# EAGLE schematic UnoRoverWithL298 (EAGLE 7.3.0)
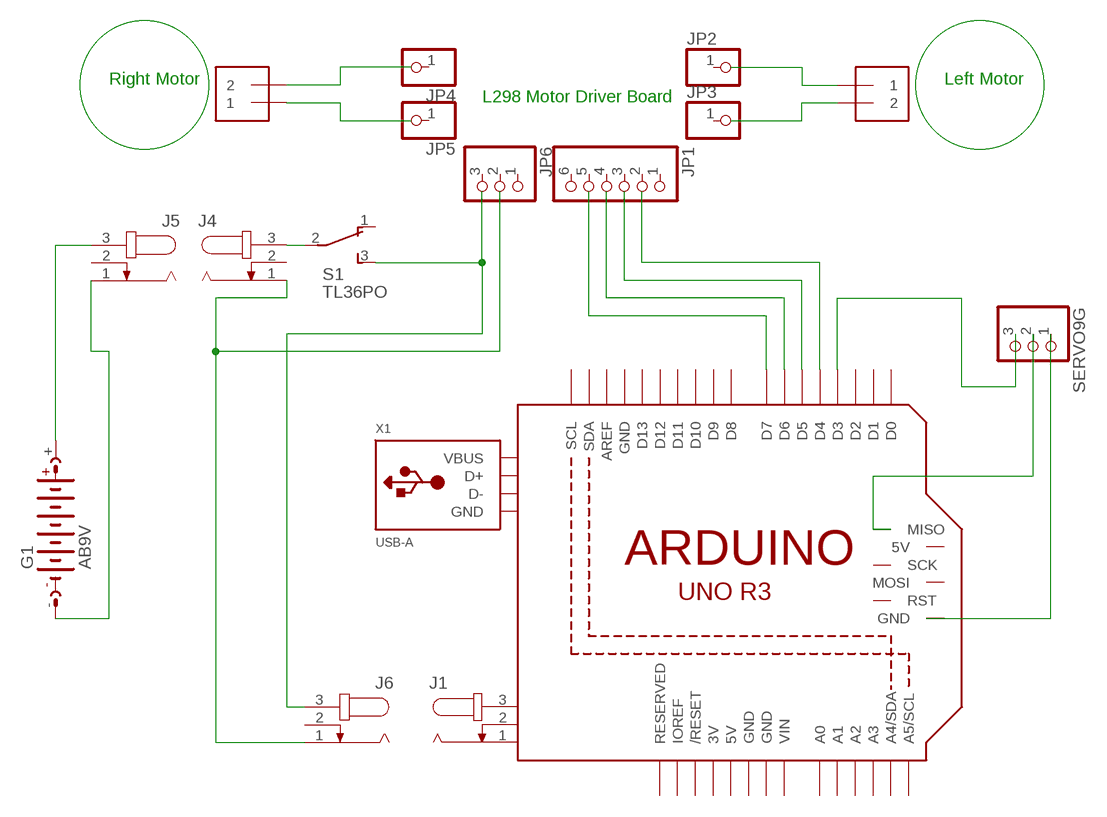
[diagram p0: schematic, sheet 1]

## Parts
G1  AB9V  [AB9V]
J1  RAPC7120  [RAPC712]
J2  1X2-3.5MM  [1X2-3.5MM]
J3  1X2-3.5MM  [1X2-3.5MM]
J4  RAPC7120  [RAPC712]
J5  RAPC7120  [RAPC712]
J6  RAPC7120  [RAPC712]
JP1  PINHD-1X6  [1X06]
JP2  PINHD-1X1  [1X01]
JP3  PINHD-1X1  [1X01]
JP4  PINHD-1X1  [1X01]
JP5  PINHD-1X1  [1X01]
JP6  PINHD-1X3  [1X03]
M1  ARDUINO_R3_ICSP  [ARDUINOR3_ICSP]
S1  TL36PO  [TL3XPO]
SERVO9G  PINHD-1X3  [1X03]
X1  USB-A  [MOLEX_480371000]

## Nets
N$1: J2.2
N$2: J2.1
N$3: J3.2
N$4: J3.1
N$5: M1.D4
N$6: M1.D5
N$7: M1.D6
N$8: M1.D7
N$9: M1.D3 SERVO9G.3
N$12: J4.3 S1.2(P)
N$13: J6.3 S1.3(S)
N$14: G1.+ J5.3
N$15: G1.- J5.1
N$16: J4.1 J6.1
Unconnected: J1.1 J1.2 J1.3 J4.2 J5.2 J6.2 JP1.1 JP1.2 JP1.3 JP1.4 JP1.5 JP1.6 JP2.1 JP3.1 JP4.1 JP5.1 JP6.1 JP6.2 JP6.3 M1.5V_ICSP(5V) M1.A0 M1.A1 M1.A2 M1.A3 M1.A4(A4/SDA) M1.A5(A5/SCL) M1.AREF M1.D0 M1.D1 M1.D2 M1.D8 M1.D9 M1.D10 M1.D11 M1.D12 M1.D13 M1.GND@2(GND) M1.IOREF M1.MISO M1.MOSI M1.RESERVED M1.RESET(/RESET) M1.RESET_ICSP(RST) M1.SCK M1.SCL M1.SDA S1.1(O) SERVO9G.1 SERVO9G.2 X1.2(D-) X1.3(D+)

## Notes on the sheet
- Right Motor | Left Motor
- L298 Motor Driver Board

## Power pins joined to a net without a drawn wire
3V: M1.3V
5V: M1.5V
GND: M1.GND M1.GND@1(GND) M1.GND@3(GND) X1.4(GND)
VBUS: X1.1(VBUS)
VIN: M1.VIN

## Library data of the parts
G1 = battery:AB9V: 9-V BATTERY CLIP
J1 J4-J6 = RepRapjr:RAPC712: DC POWER JACK Power Jack, DC, Right Angle, Through Hole, Rated 5A at 16VDC, PC Terminals Distributor: Farnell (www.Farnell.de) Drawing: 84N1161.pdf / 84N1162.pdf Manufacturer: SPC Technology (www.spctechnology.com) Type: SPC4077 / SPC 4078
J2 J3 = adafruit:1X2: 3.5mm Terminal block http://www.ladyada.net/library/pcb/eaglelibrary.html
JP1 = adafruit:PINHD-1X6: PIN HEADER
JP2-JP5 = adafruit:PINHD-1X1: Pin header 1x1 for 0.1" spacing With round pins
JP6 SERVO9G = adafruit:PINHD-1X3: PIN HEADER
M1 = adafruit:ARDUINO_R3_ICSP
S1 = switch:TL36PO: TINY SWITCH ON - ON Source: http://www2.produktinfo.conrad.com/datenblaetter/700000-724999/705152-da-01-de-Subminiaturschalter_TL_36YO.pdf
X1 = adafruit:USB-A: USB type A 'plug' Used for things that can directly connect to a USB port, say USB key